# EAGLE design schema128 (EAGLE 4.11)
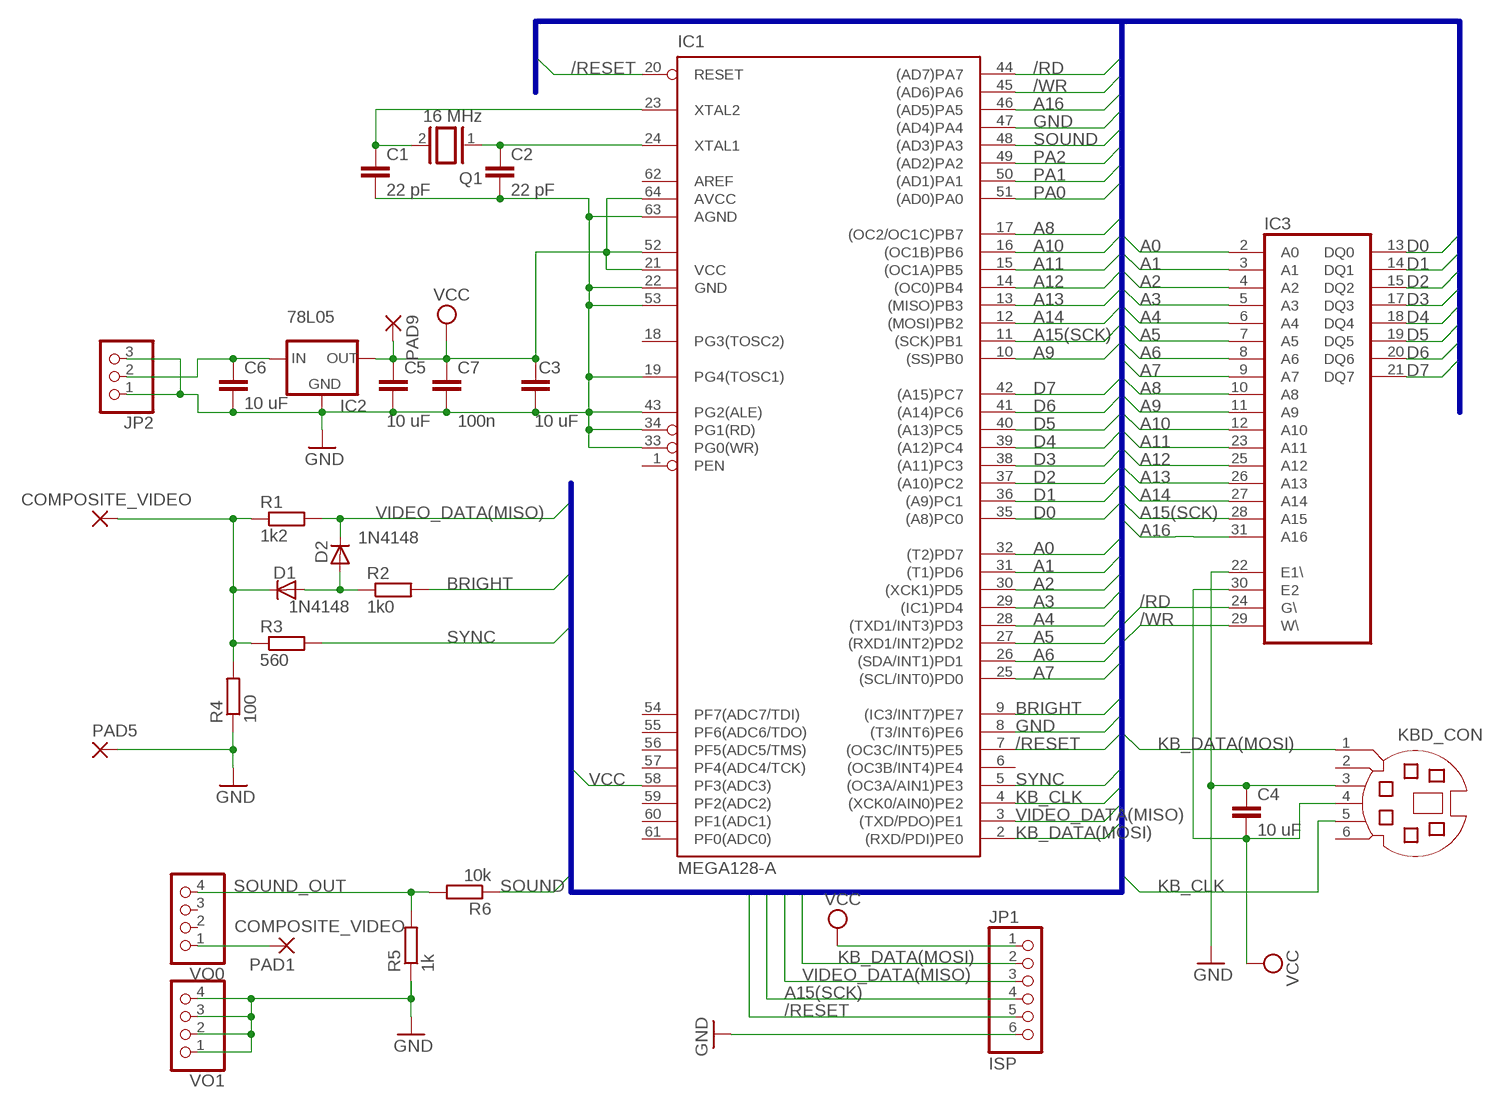
[diagram p0: schematic, sheet 1]

## Parts
C1  22 pF  C-EUC0805K  [C0805K]
C2  22 pF  C-EUC0805K  [C0805K]
C3  10 uF  C-EUC0805K  [C0805K]
C4  10 uF  C-EUC1206  [C1206]
C5  10 uF  C-EUC1206  [C1206]
C6  10 uF  C-EUC1210K  [C1210K]
C7  100n  C-EUC1206  [C1206]
COMPOSITE_VIDEO  SMD2  [SMD2]
D1  1N4148  PMLL4150  [SOD80C]
D2  1N4148  PMLL4150  [SOD80C]
IC1  MEGA128-A  [TQFP64]
IC2  78L05  78LXX  [78LXX]
IC3  MCM6226ANORMAL  [SOP32-N]
JP1  ISP  PINHD-1X6  [1X06]
JP2  PINHD-1X3  [1X03]
KBD_CON  MD06SS  [MDIN06SS]
PAD1  SMD2  [SMD2]
PAD5  SMD2  [SMD2]
PAD9  SMD2  [SMD2]
Q1  16 MHz  XTAL/S  [QS]
R1  1k2  R-EU_M1206  [M1206]
R2  1k0  R-EU_M1406  [M1406]
R3  560  R-EU_M1206  [M1206]
R4  100  R-EU_M1406  [M1406]
R5  1k  R-EU_M1206  [M1206]
R6  10k  R-EU_M1206  [M1206]
VO0  PINHD-1X4  [1X04]
VO1  PINHD-1X4  [1X04]

## Nets
/RD: IC1.44((AD7)PA7) IC3.24(G\)
/RESET: IC1.7((OC3C/INT5)PE5) IC1.20(RESET) JP1.5
/WR: IC1.45((AD6)PA6) IC3.29(W\)
A0: IC1.32((T2)PD7) IC3.2(A0)
A1: IC1.31((T1)PD6) IC3.3(A1)
A2: IC1.30((XCK1)PD5) IC3.4(A2)
A3: IC1.29((IC1)PD4) IC3.5(A3)
A4: IC1.28((TXD1/INT3)PD3) IC3.6(A4)
A5: IC1.27((RXD1/INT2)PD2) IC3.7(A5)
A6: IC1.26((SDA/INT1)PD1) IC3.8(A6)
A7: IC1.25((SCL/INT0)PD0) IC3.9(A7)
A8: IC1.17((OC2/OC1C)PB7) IC3.10(A8)
A9: IC1.10((SS)PB0) IC3.11(A9)
A10: IC1.16((OC1B)PB6) IC3.12(A10)
A11: IC1.15((OC1A)PB5) IC3.23(A11)
A12: IC1.14((OC0)PB4) IC3.25(A12)
A13: IC1.13((MISO)PB3) IC3.26(A13)
A14: IC1.12((MOSI)PB2) IC3.27(A14)
A15(SCK): IC1.11((SCK)PB1) IC3.28(A15) JP1.4
A16: IC1.46((AD5)PA5) IC3.31(A16)
BRIGHT: IC1.9((IC3/INT7)PE7) R2.2
D0: IC1.35((A8)PC0) IC3.13(DQ0)
D1: IC1.36((A9)PC1) IC3.14(DQ1)
D2: IC1.37((A10)PC2) IC3.15(DQ2)
D3: IC1.38((A11)PC3) IC3.17(DQ3)
D4: IC1.39((A12)PC4) IC3.18(DQ4)
D5: IC1.40((A13)PC5) IC3.19(DQ5)
D6: IC1.41((A14)PC6) IC3.20(DQ6)
D7: IC1.42((A15)PC7) IC3.21(DQ7)
GND: C1.2 C2.2 C3.1 C4.1 C5.2 C6.2 C7.2 IC1.8((T3/INT6)PE6) IC1.19(PG4(TOSC1)) IC1.22(GND) IC1.33(PG0(WR)) IC1.34(PG1(RD)) IC1.43(PG2(ALE)) IC1.47((AD4)PA4) IC1.53(GND1) IC1.63(AGND) IC2.GND IC3.22(E1\) JP1.6 JP2.1 JP2.3 KBD_CON.3 PAD5.1(P) R4.1 R5.1 VO1.1 VO1.2 VO1.3 VO1.4
KB_CLK: IC1.4((XCK0/AIN0)PE2) KBD_CON.5
KB_DATA(MOSI): IC1.2((RXD/PDI)PE0) JP1.2 KBD_CON.1
N$1: PAD1.1(P) VO0.1
N$4: D1.A D2.A R2.1
PA0: IC1.51((AD0)PA0)
PA1: IC1.50((AD1)PA1)
PA2: IC1.49((AD2)PA2)
SOUND: IC1.48((AD3)PA3) R6.1
SOUND_OUT: R5.2 R6.2 VO0.4
SYNC: IC1.5((OC3A/AIN1)PE3) R3.2
VCC: C3.2 C4.2 C5.1 C7.1 IC1.21(VCC) IC1.52(VCC1) IC1.58(PF3(ADC3)) IC1.64(AVCC) IC2.OUT IC3.30(E2) JP1.1 KBD_CON.4 PAD9.1(P)
VDD: C6.1 IC2.IN JP2.2
VIDEO_DATA(MISO): D2.C IC1.3((TXD/PDO)PE1) JP1.3 R1.2
VIDEO_OUT: COMPOSITE_VIDEO.1(P) D1.C R1.1 R3.1 R4.2
XTAL1: C2.1 IC1.24(XTAL1) Q1.1
XTAL2: C1.1 IC1.23(XTAL2) Q1.2
Unconnected: IC1.1(PEN) IC1.6((OC3B/INT4)PE4) IC1.18(PG3(TOSC2)) IC1.54(PF7(ADC7/TDI)) IC1.55(PF6(ADC6/TDO)) IC1.56(PF5(ADC5/TMS)) IC1.57(PF4(ADC4/TCK)) IC1.59(PF2(ADC2)) IC1.60(PF1(ADC1)) IC1.61(PF0(ADC0)) IC1.62(AREF) KBD_CON.2 KBD_CON.6 VO0.2 VO0.3

## Buses
B$1

## Power pins joined to a net without a drawn wire
GND: IC3.16(GND)
VCC: IC3.32(VCC)

## Library data of the parts
C1-C7 = rcl:C-EU: CAPACITOR, European symbol
COMPOSITE_VIDEO PAD1 PAD5 PAD9 = wirepad:SMD2: SMD PAD
D1 D2 = diode:PMLL4150: DIODE high speed
IC1 = avr:MEGA128: MICROCONTROLLER 128 Kbytes FLASH 4 Kbytes SRAM 4 Kbytes EEPROM DUAL USART 8-channel 10 bit ADC
IC2 = v-reg:78LXX: VOLTAGE REGULATOR
IC3 = memory-sram:MCM6226A: MEMORY
JP1 = pinhead:PINHD-1X6: PIN HEADER
JP2 = pinhead:PINHD-1X3: PIN HEADER
KBD_CON = con-yamaichi:MD06SS: YAMAICHI CONNECTOR
Q1 = special:XTAL/S: CRYSTAL
R1-R6 = rcl:R-EU_: RESISTOR, European symbol
VO0 VO1 = pinhead:PINHD-1X4: PIN HEADER

## Board
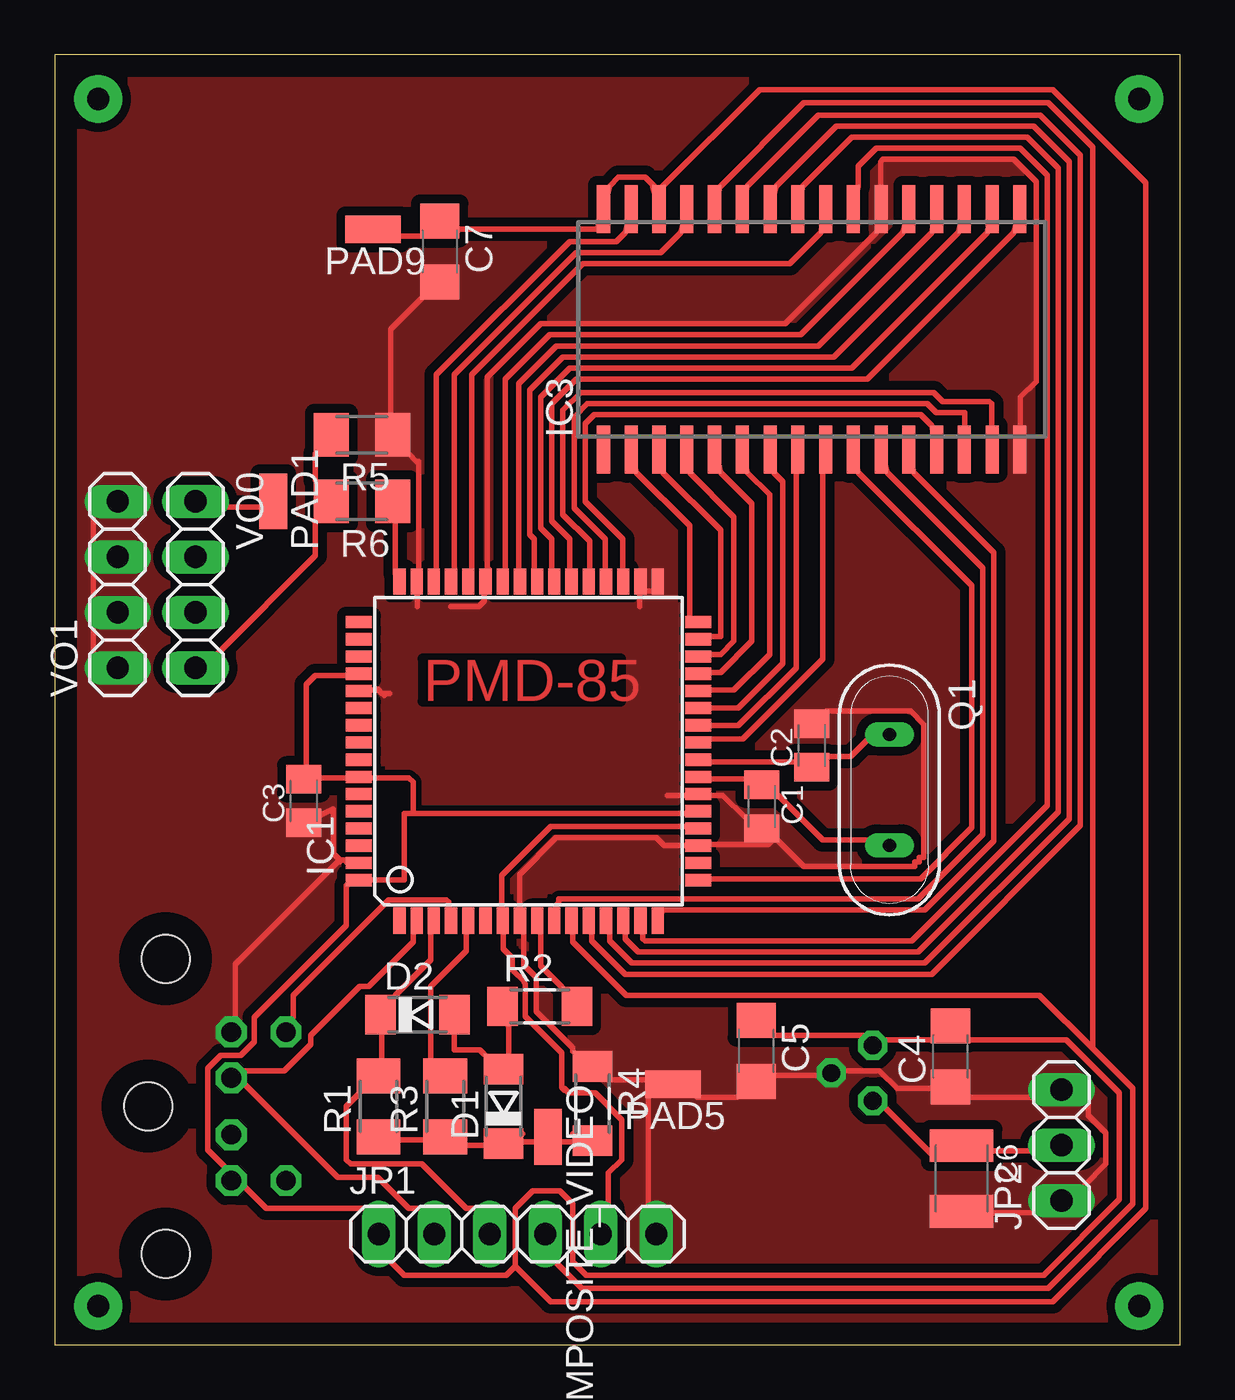
[diagram p1: board, top side]
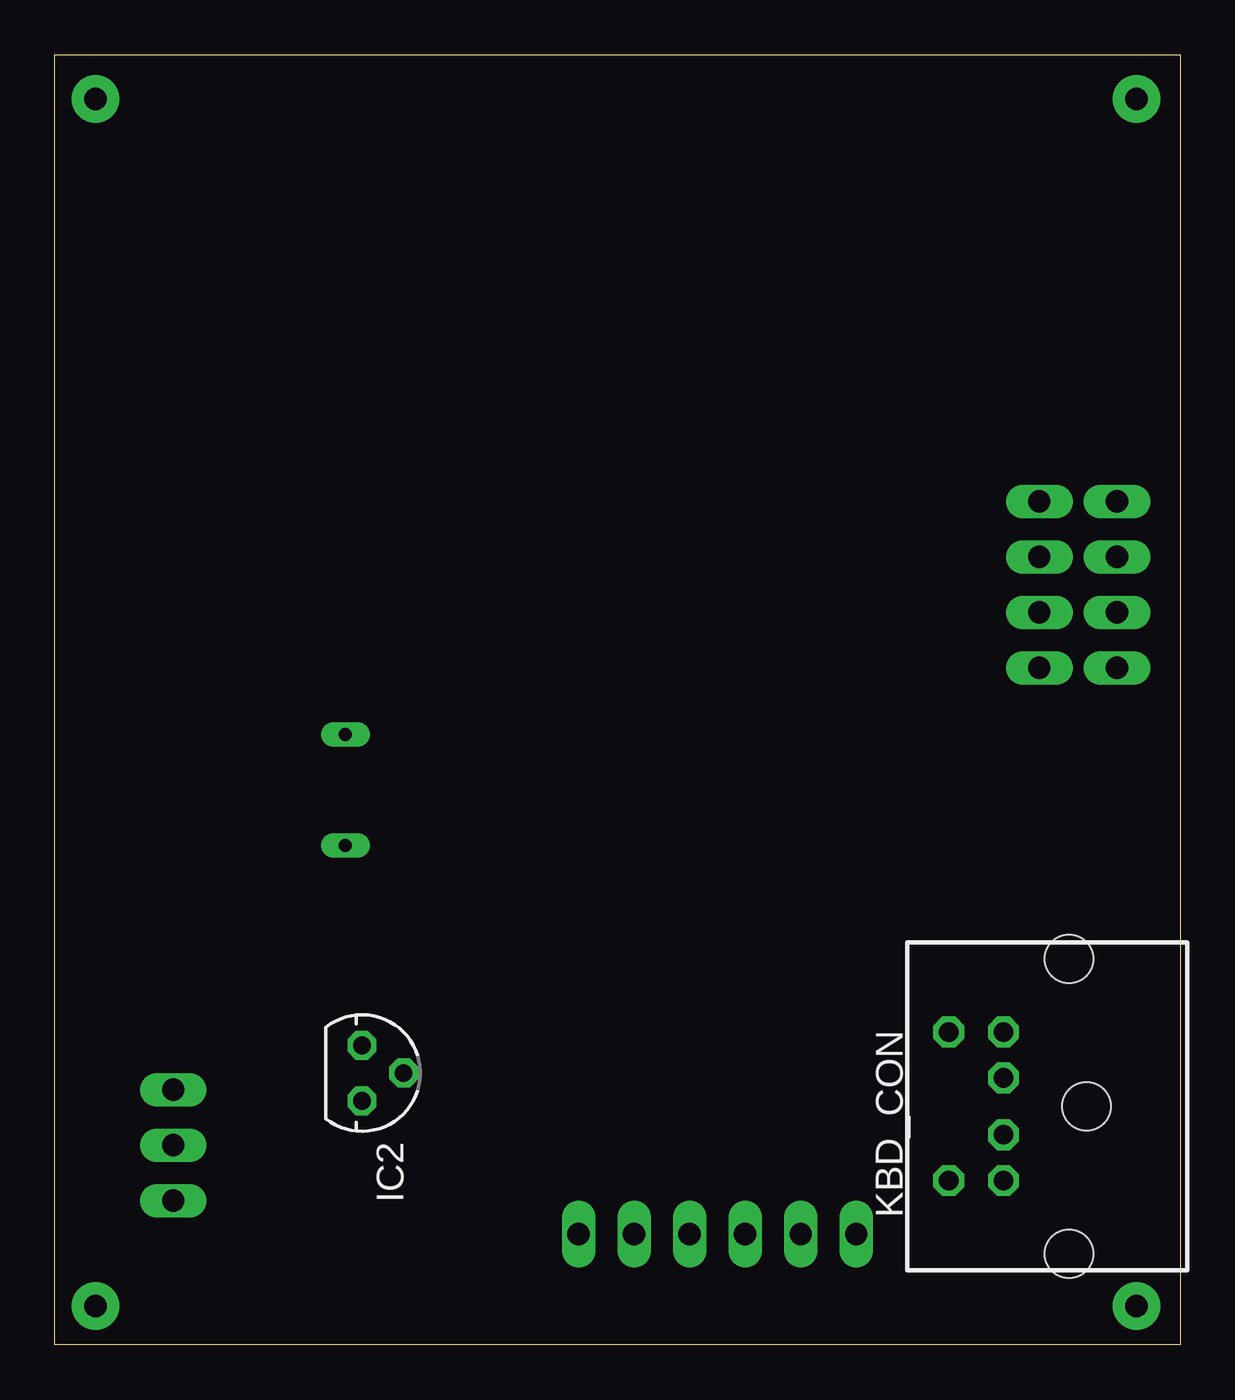
[diagram p2: board, bottom side, seen from below]

Size 51.49 x 59.04 mm. Coordinates in mm from the lower left corner, seen from the top.
Outline: 0,0 51.49,0 51.49,59.04 0,59.04 0,0
Copper layers (1*16): Top 0.035mm / dielectric 1.5mm / Bottom 0.035mm
Design rules "default": minimum track width 10mil, minimum drill 24mil, track to track 10mil, track to pad 8mil, pad to pad 8mil, via to via 8mil, smd to smd 8mil, copper to edge 40mil, drill to drill 8mil, minimum pad ring 10mil, minimum via ring 8mil, stop-mask expansion 4mil, vias tented up to drill 0mil, thermal gap 10mil

### Footprints (pad centres in the part's own frame; a part is rotated, then mirrored left to right if it is on the bottom)
C0805K = smd 1.3 x 1.6: 1 -1,0; 2 1,0
C1206 = smd 1.6 x 1.8: 1 -1.4,0; 2 1.4,0
C1210K = smd 1.5 x 2.9: 1 -1.5,0; 2 1.5,0
SMD2 = smd 1.27 x 2.54: 1 0,0
SOD80C = smd 1.4 x 1.8: A 1.7,0; C -1.7,0
TQFP64 = smd 1.194 x 0.559: 1 -7.76,5.905; 2 -7.76,5.118; 3 -7.76,4.331; 4 -7.76,3.543; 5 -7.76,2.756; 6 -7.76,1.968; 7 -7.76,1.181; 8 -7.76,0.394; 9 -7.76,-0.394; 10 -7.76,-1.181; 11 -7.76,-1.968; 12 -7.76,-2.756; 13 -7.76,-3.543; 14 -7.76,-4.331; 15 -7.76,-5.118; 16 -7.76,-5.905; 33 7.76,-5.905; 34 7.76,-5.118; 35 7.76,-4.331; 36 7.76,-3.543; 37 7.76,-2.756; 38 7.76,-1.968; 39 7.76,-1.181; 40 7.76,-0.394; 41 7.76,0.394; 42 7.76,1.181; 43 7.76,1.968; 44 7.76,2.756; 45 7.76,3.543; 46 7.76,4.331; 47 7.76,5.118; 48 7.76,5.905 | smd 0.559 x 1.194: 17 -5.905,-7.76; 18 -5.118,-7.76; 19 -4.331,-7.76; 20 -3.543,-7.76; 21 -2.756,-7.76; 22 -1.968,-7.76; 23 -1.181,-7.76; 24 -0.394,-7.76; 25 0.394,-7.76; 26 1.181,-7.76; 27 1.968,-7.76; 28 2.756,-7.76; 29 3.543,-7.76; 30 4.331,-7.76; 31 5.118,-7.76; 32 5.905,-7.76; 49 5.905,7.76; 50 5.118,7.76; 51 4.331,7.76; 52 3.543,7.76; 53 2.756,7.76; 54 1.968,7.76; 55 1.181,7.76; 56 0.394,7.76; 57 -0.394,7.76; 58 -1.181,7.76; 59 -1.968,7.76; 60 -2.756,7.76; 61 -3.543,7.76; 62 -4.331,7.76; 63 -5.118,7.76; 64 -5.905,7.76
78LXX = drill 0.813 octagon: GND 0,1.905; IN 1.27,0; OUT -1.27,0
SOP32-N = smd 0.6 x 2.2: 1 -9.525,-5.5; 2 -8.255,-5.5; 3 -6.985,-5.5; 4 -5.715,-5.5; 5 -4.445,-5.5; 6 -3.175,-5.5; 7 -1.905,-5.5; 8 -0.635,-5.5; 9 0.635,-5.5; 10 1.905,-5.5; 11 3.175,-5.5; 12 4.445,-5.5; 13 5.715,-5.5; 14 6.985,-5.5; 15 8.255,-5.5; 16 9.525,-5.5; 17 9.525,5.5; 18 8.255,5.5; 19 6.985,5.5; 20 5.715,5.5; 21 4.445,5.5; 22 3.175,5.5; 23 1.905,5.5; 24 0.635,5.5; 25 -0.635,5.5; 26 -1.905,5.5; 27 -3.175,5.5; 28 -4.445,5.5; 29 -5.715,5.5; 30 -6.985,5.5; 31 -8.255,5.5; 32 -9.525,5.5
1X06 = drill 1.016 long: 1 -6.35,0; 2 -3.81,0; 3 -1.27,0; 4 1.27,0; 5 3.81,0; 6 6.35,0
1X03 = drill 1.016 long: 1 -2.54,0; 2 0,0; 3 2.54,0
MDIN06SS = drill 0.9 octagon: 1 1.3,8.5; 2 -1.3,8.5; 3 3.4,8.5; 4 -3.4,8.5; 5 3.4,11; 6 -3.4,11 | hole 2.2: -6.75,5.5; 0,4.7; 6.75,5.5
QS = drill 0.61 long: 1 -2.54,0; 2 2.54,0
M1206 = smd 1.6 x 2: 1 -1.4,0; 2 1.4,0
M1406 = smd 1.4 x 1.8: 1 -1.7,0; 2 1.7,0
1X04 = drill 1.016 long: 1 -3.81,0; 2 -1.27,0; 3 1.27,0; 4 3.81,0

### Placement (x,y rotation side)
C1  32.35,24.63 270 top
C2  34.63,27.43 90 top
C3  11.39,24.89 90 top
C4  40.98,13.2 90 top
C5  32.09,13.46 270 top
C6  41.49,7.62 270 top
C7  17.61,50.03 270 top
COMPOSITE_VIDEO  22.57,9.52 180 top
D1  20.54,10.92 90 top
D2  16.6,15.11 0 top
IC1  21.68,27.17 90 top
IC2  37.43,12.44 270 bottom
IC3  34.63,46.48 0 top
JP1  21.17,5.07 0 top
JP2  46.06,9.14 90 top
KBD_CON  -0.42,10.92 90 bottom
PAD1  10,38.6 180 top
PAD5  28.28,11.93 90 top
PAD9  14.57,51.05 90 top
Q1  38.19,25.4 270 top
R1  14.82,10.92 90 top
R2  22.19,15.49 0 top
R3  17.87,10.92 90 top
R4  24.6,11.04 270 top
R5  14.06,41.65 180 top
R6  14.06,38.6 180 top
VO0  6.44,34.79 270 top
VO1  2.88,34.79 90 top

### Tracks (layer width: path | path; a pad name or v marks a point on that pad's centre or on a via)
/RD
  Top 0.254: IC1.44 19.09,35.45 19.09,44.39 24.17,49.47 33.62,49.47 35.04,50.9 IC3.24
/RESET
  Top 0.254: IC1.20 28.99,23.72 22.69,23.72 20.46,21.48 20.46,19.86 IC1.7 20.51,18.84 20.51,18.13 20.94,17.7 20.94,17.17 21.48,16.63 21.48,16.58 21.53,16.53 21.53,15.03 23.2,13.35 23.2,11.78 | 23.2,11.78 23.33,11.65 | 25.54,6.24 JP1.5 25.34,6.45 25.34,7.87 25.95,8.48 25.95,10.31 24.73,11.53 23.51,11.53 23.3,11.73 23.2,11.78
/WR
  Top 0.254: IC1.45 18.28,35.45 18.28,44.39 23.86,49.98 27.72,49.98 28.64,50.9 IC3.29
A0
  Top 0.254: IC1.32 29.04,33.22 29.04,37.48 26.61,39.92 IC3.2
A1
  Top 0.254: IC1.31 29.86,32.41 30.47,32.41 30.47,37.28 27.83,39.92 IC3.3
A2
  Top 0.254: IC1.30 29.86,31.59 30.47,31.59 31.08,32.2 31.08,37.89 29.04,39.92 IC3.4
A3
  Top 0.254: IC1.29 29.86,30.78 30.47,30.78 31.89,32.2 31.89,38.5 30.47,39.92 IC3.5
A4
  Top 0.254: IC1.28 29.86,29.97 31.08,29.97 32.7,31.59 32.7,38.91 31.69,39.92 IC3.6
A5
  Top 0.254: IC1.27 29.86,29.15 31.28,29.15 33.31,31.19 33.31,39.52 32.91,39.92 IC3.7
A6
  Top 0.254: IC1.26 29.86,28.34 31.28,28.34 33.92,30.98 33.92,39.92 IC3.8
A7
  Top 0.254: IC1.25 29.86,27.73 31.48,27.73 35.14,31.39 35.14,39.92 IC3.9
A8
  Top 0.254: IC1.17 29.96,21.33 39.61,21.33 41.95,23.67 41.95,34.74 36.77,39.92 IC3.10
A9
  Top 0.254: IC3.11 38.09,39.92 42.46,35.55 42.46,23.36 39.51,20.42 23.05,20.42 23.05,20.21 22.95,20.11 22.95,19.91 IC1.10
A10
  Top 0.254: IC1.16 27.83,19.91 39.81,19.91 42.96,23.06 42.96,36.27 39.31,39.92 IC3.12
A11
  Top 0.254: IC1.15 26.91,18.89 26.91,18.59 27.01,18.49 39.2,18.49 45.4,24.68 45.4,53.54 44.18,54.76 37.58,54.76 36.77,53.95 36.77,53.03 IC3.23
A12
  Top 0.254: IC1.14 26.1,18.89 26.1,18.59 26.71,17.98 39.51,17.98 45.91,24.38 45.91,53.84 44.49,55.27 36.46,55.27 34.23,53.03 IC3.25
A13
  Top 0.254: IC1.13 25.39,18.89 25.39,18.49 26.4,17.47 39.81,17.47 46.42,24.07 46.42,54.15 44.79,55.77 35.75,55.77 33.01,53.03 IC3.26
A14
  Top 0.254: IC1.12 24.57,18.89 24.57,18.49 26.1,16.96 40.12,16.96 46.93,23.77 46.93,54.45 45.1,56.28 34.94,56.28 31.69,53.03 IC3.27
A15(SCK)
  Top 0.254: 47.48,13.56 49.31,11.73 49.31,6.45 45.45,2.59 24.12,2.59 22.9,3.81 JP1.4 | 47.48,13.56 45.05,16 26.15,16 23.71,18.44 23.71,18.84 IC1.11 | 47.48,13.56 47.48,54.81 45.45,56.84 34.28,56.84 30.42,52.98 IC3.28
A16
  Top 0.254: 17.36,34.54 IC1.46 17.46,35.45 17.46,44.39 23.56,50.49 25.69,50.49 26.1,50.9 IC3.31
BRIGHT
  Top 0.254: IC1.9 22.24,18.84 22.24,17.34 23.2,16.38 R2.2
D0
  Top 0.254: IC3.13 40.12,42.06 39.61,42.56 24.68,42.56 24.27,42.16 24.27,38.6 26,36.88 26,35.45 IC1.35
D1
  Top 0.254: IC3.14 41.64,42.06 41.64,42.67 40.32,42.67 39.92,43.07 24.37,43.07 23.76,42.46 23.76,38.3 25.18,36.88 25.18,35.45 IC1.36
D2
  Top 0.254: IC1.37 24.47,35.45 24.47,36.77 23.25,37.99 23.25,42.77 24.07,43.58 40.22,43.58 40.63,43.17 42.76,43.17 42.86,43.07 42.86,42.06 IC3.15
D3
  Top 0.254: IC1.38 23.56,35.45 23.56,36.88 22.75,37.69 22.75,43.07 23.86,44.19 37.17,44.19 43.88,50.9 IC3.17
D4
  Top 0.254: IC1.39 22.75,35.45 22.75,36.88 22.24,37.38 22.24,43.38 23.56,44.7 36.46,44.7 42.66,50.9 IC3.18
D5
  Top 0.254: IC1.40 21.93,35.45 21.93,36.88 21.73,37.08 21.73,43.68 23.25,45.21 35.65,45.21 41.34,50.9 IC3.19
D6
  Top 0.254: IC1.41 21.22,35.45 21.22,43.99 22.95,45.71 34.94,45.71 40.12,50.9 IC3.20
D7
  Top 0.254: IC1.42 20.61,35.45 20.61,44.19 22.64,46.22 34.12,46.22 38.8,50.9 IC3.21
GND
  Top 0.254: 16.6,33.78 16.6,34.54 IC1.47 16.65,35.45 16.65,40.43 16.55,40.43 16.24,40.74 R5.1 15.38,42.62 15.38,46.48 16.8,47.9 C7.2 | 37.78,53.03 37.78,54.15 37.88,54.25 43.88,54.25 44.9,53.23 44.9,44.09 44.18,43.38 44.18,42.06 IC3.16 | 37.58,50.9 33.41,46.73 22.24,46.73 19.8,44.29 19.8,35.5 | 19.8,35.5 19.8,35.45 | 13.04,22.2 13.35,22.2 13.35,22.09 IC1.63 | 13.04,22.2 12.74,22.5 12.74,24.53 C3.1 | 13.04,22.2 13.04,22.09 12.94,22.09 8.27,17.42 8.27,14.98 | 14.77,29.97 14.31,29.97 IC1.53 | 14.77,29.97 14.82,29.97 14.97,29.82 | 14.97,29.82 15.07,29.71 | 18.12,33.78 19.39,33.78 19.65,34.03 19.65,34.54 IC1.43 19.85,35.5 19.8,35.5 | IC1.19 29.04,22.86 | 28.03,25.14 29.04,25.14 IC1.22 29.81,25.14 30.57,25.14 31.58,24.12 31.64,24.12 C1.2 | 26.76,34.49 26.9,34.49 | 14.77,29.97 14.77,30.02 14.87,29.93 | IC1.33 27.37,34.49 26.96,34.49 IC1.34 26.76,34.49 | 26.76,33.78 26.76,34.49 | 14.97,29.82 15.33,29.82 | IC1.19 28.99,22.91 28.89,22.86 27.88,22.86 27.52,23.21 22.95,23.21 21.27,21.53 21.27,19.96 IC1.8 21.45,18.84 21.45,17.39 22.04,16.81 22.04,15.26 23.71,13.58 23.71,13.43 R4.1 25.34,12.14 27.17,12.14 PAD5.1 | 41.8,11.32 44.64,11.32 JP2.3 47.28,11.12 47.28,10.51 48.09,9.7 48.09,8.28 47.08,7.26 JP2.1 44.84,6.04 42.81,6.04 C6.2 | JP1.6 27.17,6.45 27.17,11.32 PAD5.1 | 40.17,11.73 38.55,11.73 37.73,12.54 36.11,12.54 IC2.GND 34.89,12.34 32.86,12.34 C5.2 31.23,11.32 29.4,11.32 PAD5.1 | VO1.4 1.77,37.94 1.77,36.72 VO1.3 1.77,35.5 1.77,34.08 VO1.2 1.77,32.86 1.77,31.64 VO1.1 | C2.2 35.29,29 39.15,29 39.76,28.39 39.76,22.3 39.56,22.3 39.56,22.09 39.36,22.09 39.36,21.89 34.28,21.89 33.06,23.11 C1.2
  Top 0.254: C1.2 32.86,23.11 32.65,22.91 30.01,22.91 IC1.19
  pour Top (no thermals): 15.33,33.78 28.54,33.78 28.54,20.82 15.33,20.82
  pour Top (isolate 0.406, no thermals): 0.09,58.92 51.52,58.92 51.52,-0.13 0.09,-0.13
KB_CLK
  Top 0.254: IC1.4 18.02,19.96 18.02,20.26 17.92,20.37 15.28,20.37 10.91,16 10.91,14.98 KBD_CON.5
KB_DATA(MOSI)
  Top 0.254: IC1.2 16.4,18.84 16.4,18.44 14.36,16.4 13.96,16.4 11.72,14.17 11.72,13.76 10.5,12.54 8.67,12.54 KBD_CON.1 8.67,11.93 12.94,7.67 14.77,7.67 16.19,6.24 16.8,6.24 JP1.2
N$1
  Top 0.254: PAD1.1 9.49,38.35 7.86,38.35 VO0.1
N$2  (via drill 1.02 pad 2.18)
  other vias: 1.99,57.02
N$3  (via drill 1.02 pad 2.18)
  other vias: 49.62,57.02
N$4
  Top 0.254: D2.A 18.28,14.22 18.28,13.51 19.44,13.51 19.65,13.3 D1.A 20.76,13.3 20.76,14.52 R2.1
N$5  (via drill 1.02 pad 2.18)
  other vias: 1.99,1.77
N$6  (via drill 1.02 pad 2.18)
  other vias: 49.62,1.77
SOUND
  Top 0.254: IC1.48 15.58,35.3 15.58,37.84 R6.1
SOUND_OUT
  Top 0.254: R6.2 11.87,37.69 | R6.2 11.93,39.57 11.93,40.79 R5.2 | R6.2 11.93,37.74 11.93,36.11 7.45,31.64 VO0.4
SYNC
  Top 0.254: IC1.5 18.83,18.84 18.83,18.03 17.21,16.4 17.21,12.95 R3.2
VCC
  Top 0.254: 16.4,24.33 15.99,24.33 15.99,21.28 14.36,21.28 IC1.64 13.35,21.03 13.35,19.2 9.13,14.98 9.13,13.86 8.52,13.25 7.61,13.25 7,12.64 7,8.94 7.76,8.17 KBD_CON.4 8.67,7.26 9.69,6.24 14.16,6.24 JP1.1 15.38,3.81 15.99,3.19 20.66,3.19 21.07,3.6 | 16.4,24.33 28.99,24.33 IC1.21 | C5.1 32.86,14.17 37.12,14.17 IC2.OUT 37.94,13.96 40.17,13.96 C4.2 41.8,13.96 46.27,13.96 48.7,11.53 48.7,6.65 45.25,3.19 24.32,3.19 23.71,3.81 23.71,6.45 23.1,7.06 21.88,7.06 21.07,6.24 21.07,3.6 | 21.07,3.6 22.69,1.98 45.66,1.98 49.92,6.24 49.92,53.18 45.66,57.45 32.25,57.45 27.78,52.98 IC3.30 27.37,52.98 27.42,53.03 27.01,53.44 25.79,53.44 25.39,53.03 IC3.32 24.83,51.05 18.43,51.05 18.43,50.95 C7.1 16.8,50.74 15.79,50.74 PAD9.1 | IC1.52 13.35,30.63 11.93,30.63 11.52,30.22 11.52,26.36 C3.2 12.13,25.95 13.35,25.95 IC1.58 14.36,25.95 16.19,25.95 16.4,25.75 16.4,24.33
VDD
  Top 0.254: IC2.IN 37.94,10.92 40.17,8.68 C6.1 42.81,8.88 44.64,8.88 JP2.2
VIDEO_DATA(MISO)
  Top 0.254: IC1.3 17.21,18.84 17.21,17.62 15.58,16 D2.C 14.97,14.37 14.97,12.95 R1.2 13.96,11.53 13.35,10.92 13.35,8.48 13.55,8.28 16.8,8.28 18.83,6.24 19.24,6.24 JP1.3
VIDEO_OUT
  Top 0.254: D1.C 19.65,9.14 18.63,9.14 R3.1 17.11,9.39 15.58,9.39 R1.1 | 23.71,9.65 R4.2 23.71,9.29 23.1,9.29 COMPOSITE_VIDEO.1 22.08,9.29 21.27,9.29 D1.C | D1.C 21.43,9.65
XTAL1
  Top 0.254: IC1.24 29.81,26.67 33.87,26.67 C2.1 35.39,26.92 36.41,26.92 37.17,27.68 Q1.1
XTAL2
  Top 0.254: IC1.23 29.93,25.9 31.58,25.9 C1.1 33.11,25.14 35.14,23.11 37.17,23.11 Q1.2

### Text on the board
Top: PMD-85